# Altium schematic sheet 转速检测.SchDoc
size A4
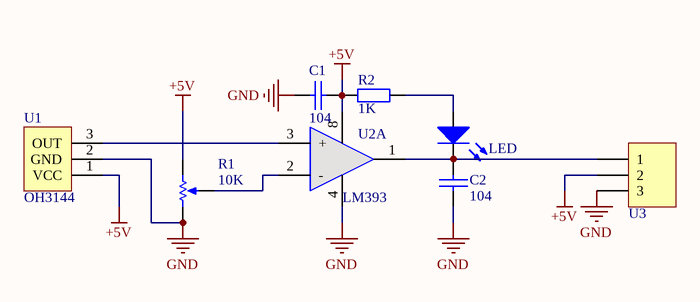
[diagram p0: 转速检测.SchDoc]

## Parts
C1  104  [0603C]
C2  104  [0603C]
LED  COLOUR  [0603LED]  (value not drawn)
R1  value 10K  [3x3dianweiqi]  (hidden comment: RPot)
R2  value 1K  [0603-1]  (hidden comment: Res1)
U1  OH3144  [OH3144]
U2  LM393  [NSO8_N]  (part A of 2)
U3  Header 3  [HDR3X1_A]  (value not drawn)

## Nets
+5V: C1.2 R1.3(BOT) R2.1 U1.1(VCC) U2.8(V+) U3.2
GND: C1.1 C2.1 R1.1(TOP) U1.2(GND) U2.4(V-) U3.3
NetC2_2: C2.2 LED.2(-) U2.1(OUT1) U3.1
NetLED_1: LED.1(+) R2.2
NetR1_2: R1.2(TAP) U2.2(-)
NetU1_3: U1.3(OUT) U2.3(+)

## Library data of the parts
C1 C2 = CAP X: 安规电容
LED = ledφ6
R1 = RPot: 精密可调电阻; Sim Note: Enter the Resistance value and the set point into parameter fields.; Set Position: 0.5; Published: 8-Jun-2000; LatestRevisionDate: 17-Jul-2002; LatestRevisionNote: Re-released for DXP Platform.; PackageReference: VR5; Publisher: Altium Limited
R2 = Res1: 贴片电阻; Published: 8-Jun-2000; LatestRevisionDate: 17-Jul-2002; LatestRevisionNote: Re-released for DXP Platform.; PackageReference: AXIAL-0.4; Publisher: Altium Limited
U1 = OH3144: 国产霍尔开关
U2 = LM393: 比较器
U3 = Header 3: 接插件; LatestRevisionDate: 17-Jul-2002; LatestRevisionNote: Re-released for DXP Platform.; Publisher: Altium Limited